# EAGLE design schematicNew (EAGLE 9.6.2)
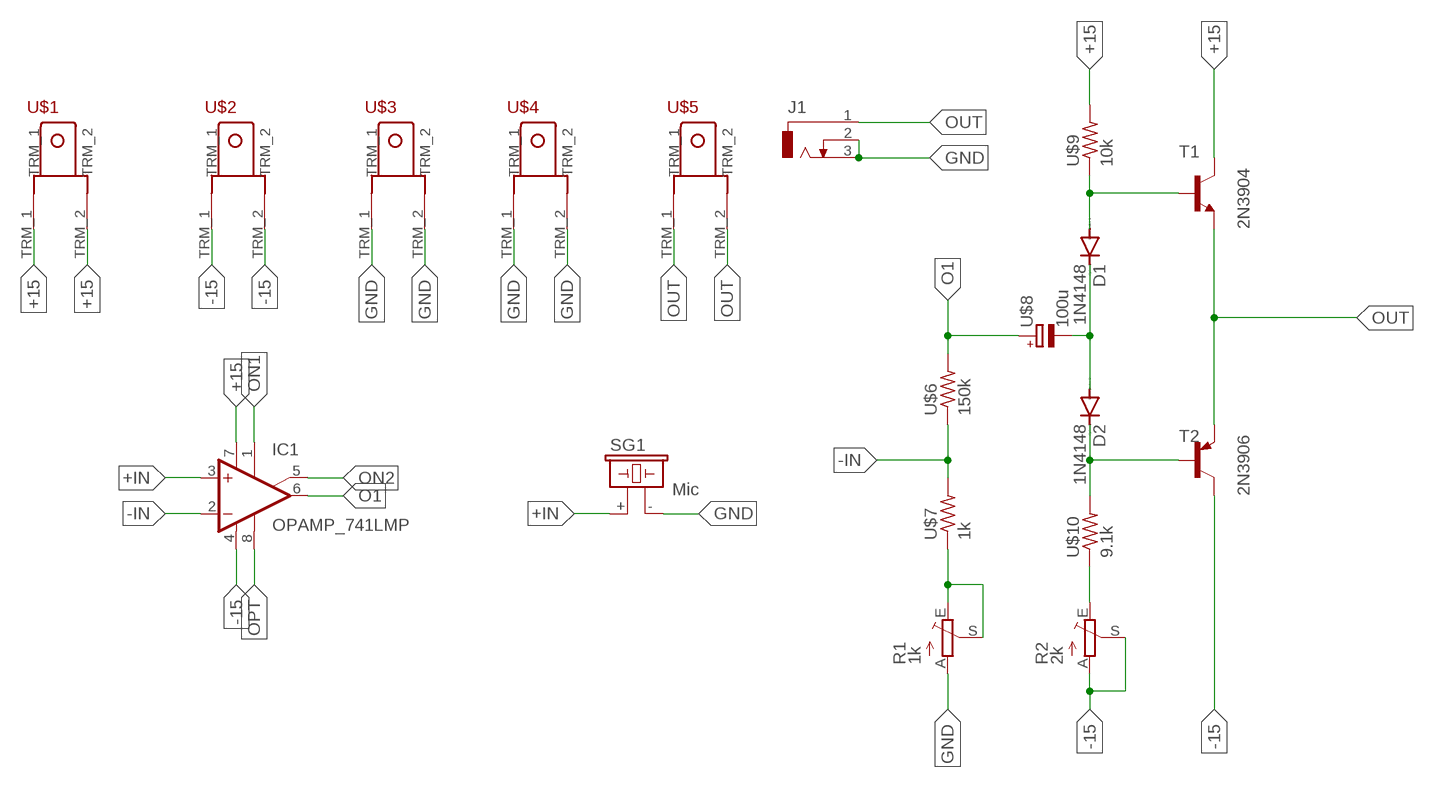
[diagram p0: schematic, sheet 1]

## Parts
D1  1N4148  1N4148DO35-10  [DO35-10]
D2  1N4148  1N4148DO35-10  [DO35-10]
IC1  OPAMP_741LMP  [DIL08]
J1  CON_JACK  [DCJ0303]
R1  1k  TRIM_EU-CA6V  [CA6V]
R2  2k  TRIM_EU-CA6V  [CA6V]
SG1  Mic  BUZZER  [F/CM12P]
T1  2N3904  2N3904-NPN-TO92-EBC  [TO92-EBC]
T2  2N3906  2N3906-PNP-TO92-EBC  [TO92-EBC]
U$1  TERMINAL_EDITED  [TERMINAL_EDITED]
U$2  TERMINAL_EDITED  [TERMINAL_EDITED]
U$3  TERMINAL_EDITED  [TERMINAL_EDITED]
U$4  TERMINAL_EDITED  [TERMINAL_EDITED]
U$5  TERMINAL_EDITED  [TERMINAL_EDITED]
U$6  150k  RES-7  [0204/7]
U$7  1k  RES-7  [0204/7]
U$8  100u  CAP_POL  [E3,5-8]
U$9  10k  RES-7  [0204/7]
U$10  9.1k  RES-7  [0204/7]

## Nets
+15: IC1.7(V+) T1.C U$1.TRM_1 U$1.TRM_2 U$9.2
+IN: IC1.3(+IN) SG1.+
-15: IC1.4(V-) R2.A R2.S T2.C U$2.TRM_1 U$2.TRM_2
-IN: IC1.2(-IN) U$6.1 U$7.2
GND: J1.2 J1.3 R1.A SG1.- U$3.TRM_1 U$3.TRM_2 U$4.TRM_1 U$4.TRM_2
N$1: D1.C D2.A U$8.-
N$2: D1.A T1.B U$9.1
N$3: R1.E R1.S U$7.1
N$4: D2.C T2.B U$10.2
N$5: R2.E U$10.1
O1: IC1.6(OUT) U$6.2 U$8.+
ON1: IC1.1(ON1)
ON2: IC1.5(ON2)
OPT: IC1.8(OPT)
OUT: J1.1 T1.E T2.E U$5.TRM_1 U$5.TRM_2

## Library data of the parts
D1 D2 = diode:1N4148: DIODE high speed (Philips)
IC1 = MIA_LIBRARY-2-2-2:OPAMP_741: OP AMP
J1 = MIA_LIBRARY-2-2-2:CON_JACK: DC POWER JACK Source: DCJ0303.pdf; OC_FARNELL: unknown; OC_NEWARK: unknown
R1 R2 = MIA_LIBRARY-2-2-2:TRIM_EU-: POTENTIOMETER
SG1 = MIA_LIBRARY-2-2-2:BUZZER: BUZZER Source: Buerklin; OC_FARNELL: unknown; OC_NEWARK: unknown
T1 = transistor-neu-to92:*-NPN-: NPN Transistror
T2 = transistor-neu-to92:*-PNP-: PNP Transistror
U$1-U$5 = MIA_LIBRARY-2-2-2:TERMINAL_EDITED
U$6 U$7 U$9 U$10 = MIA_LIBRARY-2-2-2:RES-7
U$8 = MIA_LIBRARY-2-2-2:CAP_POL

## Board
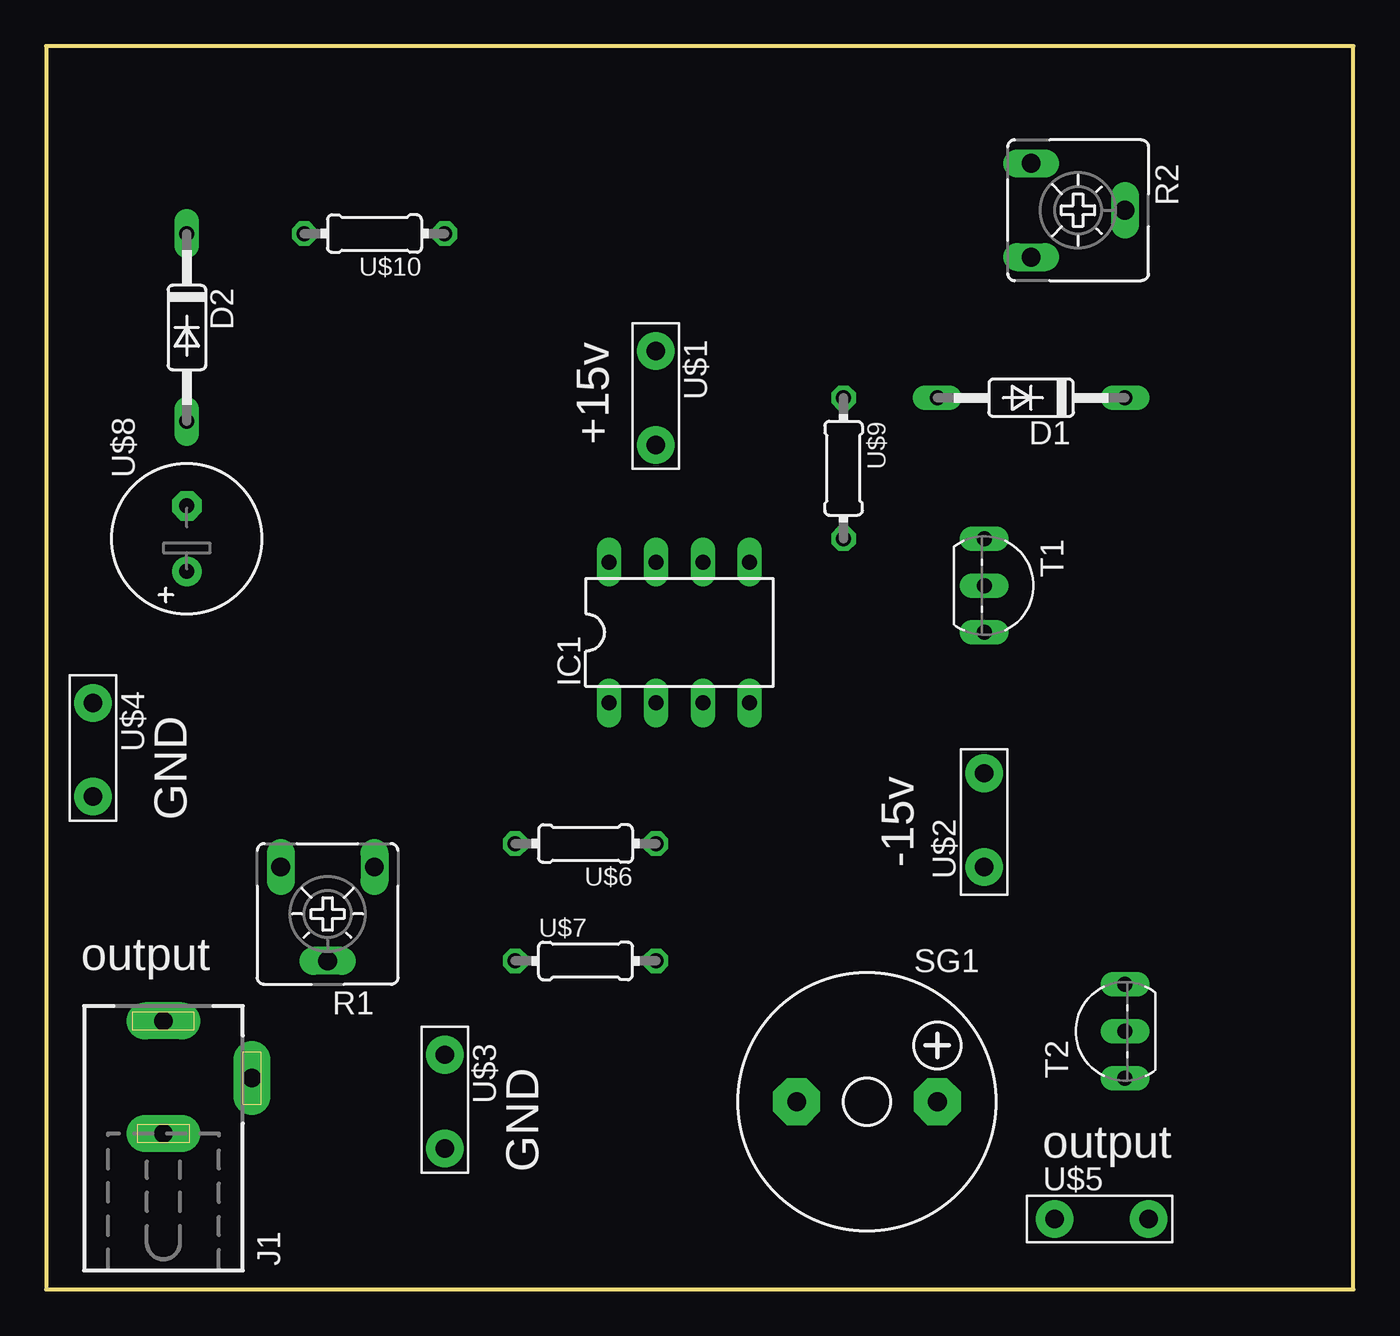
[diagram p1: board, top side]
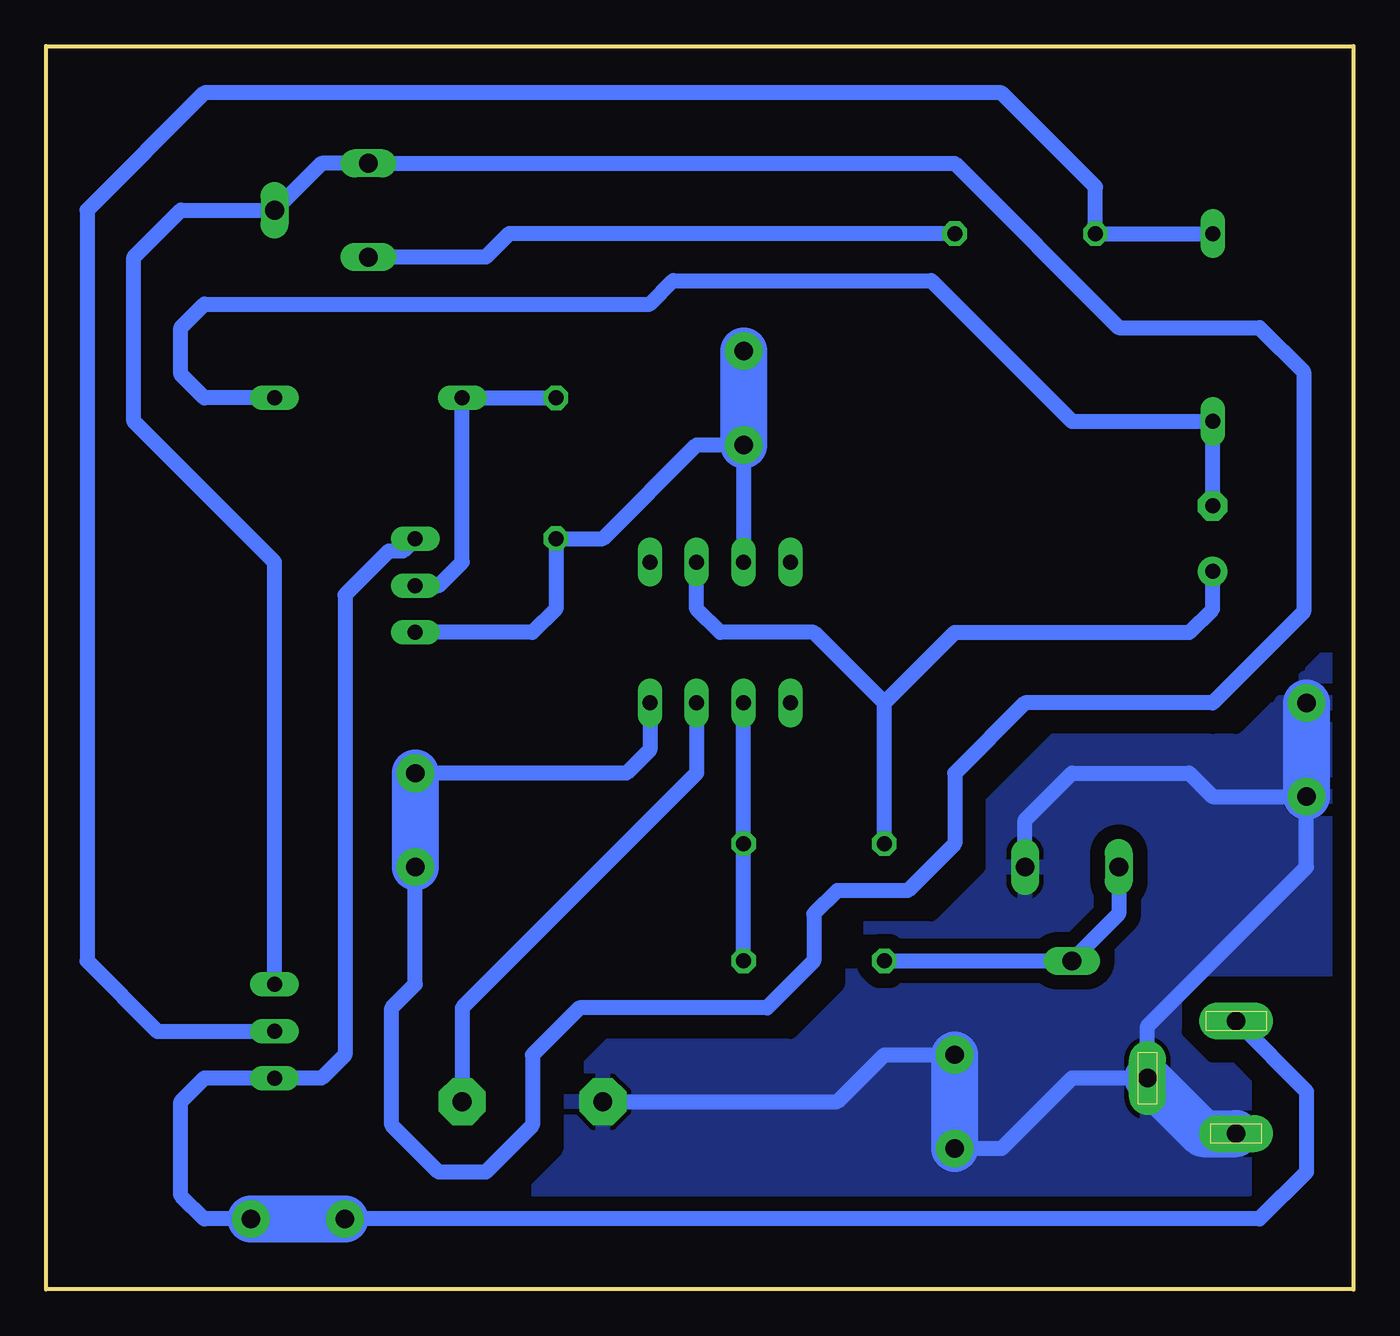
[diagram p2: board, bottom side, seen from below]

Size 70.79 x 67.3 mm. Coordinates in mm from the lower left corner, seen from the top.
Outline: 0,0 70.79,0 70.79,67.3 0,67.3 0,0
Copper layers (1*16): Top 0.035mm / dielectric 1.5mm / Bottom 0.035mm
Design rules "default *": minimum track width 6mil, minimum drill 0.35mm, track to track 0.8mm, track to pad 0.8mm, pad to pad 0.8mm, via to via 0.8mm, smd to smd 0.8mm, copper to edge 40mil, drill to drill 6mil, minimum pad ring 10mil, minimum via ring 8mil, stop-mask expansion 4mil, vias tented up to drill 0mil, thermal gap 10mil

### Footprints (pad centres in the part's own frame; a part is rotated, then mirrored left to right if it is on the bottom)
DO35-10 = drill 0.813 long: A 5.08,0; C -5.08,0
DIL08 = drill 0.813 long: 1 -3.81,-3.81; 2 -1.27,-3.81; 3 1.27,-3.81; 4 3.81,-3.81; 5 3.81,3.81; 6 1.27,3.81; 7 -1.27,3.81; 8 -3.81,3.81
DCJ0303 = drill 1 pad 2 long: 1 0,3.1; 2 4.8,0; 3 0,-3
CA6V = drill 1.016 long: A -2.54,-2.54; E 2.54,-2.54; S 0,2.54
F/CM12P = drill 1.016 pad 2.54 octagon: + 3.81,0; - -3.81,0
TO92-EBC = drill 0.813 long: B 0,-1.27; C 2.54,-1.27; E -2.54,-1.27
TERMINAL_EDITED = drill 1 pad 2.032: TRM_1 -2.54,0; TRM_2 2.54,0
0204/7 = drill 0.813 octagon: 1 -3.81,0; 2 3.81,0
E3,5-8 = drill 0.813 pad 1.6: + -1.778,0 | drill 0.813 pad 1.6 octagon: - 1.778,0

### Placement (x,y rotation side)
D1  53.34,48.26 180 top
D2  7.62,52.07 270 top
IC1  34.29,35.56 0 top
J1  6.35,11.43 0 top
R1  15.24,20.32 180 top
R2  55.88,58.42 270 top
SG1  44.45,10.16 0 top
T1  52.07,38.1 270 top
T2  57.15,13.97 90 top
U$1  33.02,48.26 270 top
U$2  50.8,25.4 90 top
U$3  21.59,10.16 270 top
U$4  2.54,29.21 270 top
U$5  57.15,3.81 0 top
U$6  29.21,24.13 180 top
U$7  29.21,17.78 0 top
U$8  7.62,40.64 90 top
U$9  43.18,44.45 270 top
U$10  17.78,57.15 180 top

### Tracks (layer width: path | path; a pad name or v marks a point on that pad's centre or on a via)
+15
  Bottom 0.813: IC1.7 U$1.TRM_2 35.56,45.72 40.64,40.64 U$9.2 43.18,36.83 44.45,35.56 T1.C
  Bottom 2.54: U$1.TRM_1 U$1.TRM_2
+IN
  Bottom 0.813: IC1.3 35.56,27.94 48.26,15.24 SG1.+
-15
  Bottom 0.813: IC1.4 38.1,29.21 39.37,27.94 U$2.TRM_2 | U$2.TRM_1 50.8,16.51 52.07,15.24 52.07,8.89 49.53,6.35 46.99,6.35 44.45,8.89 44.45,12.7 41.91,15.24 31.75,15.24 29.21,17.78 29.21,20.32 27.94,21.59 24.13,21.59 21.59,24.13 21.59,27.94 17.78,31.75 7.62,31.75 2.69,36.68 2.69,49.68 5.08,52.07 12.7,52.07 21.59,60.96 R2.A 55.88,60.96 R2.S 63.5,58.42 66.04,55.88 66.04,46.99 58.42,39.37 T2.C
  Bottom 2.54: U$2.TRM_2 U$2.TRM_1
-IN
  Bottom 0.813: U$7.2 U$6.1 IC1.2
GND
  Bottom 0.813: U$3.TRM_2 19.05,7.62 15.24,11.43 J1.2 11.15,14.25 2.54,22.86 U$4.TRM_2 7.62,26.67 8.89,27.94 15.24,27.94 17.78,25.4 R1.A | SG1.- 27.94,10.16 25.4,12.7 U$3.TRM_1
  Bottom 2.54: U$3.TRM_2 U$3.TRM_1 | U$4.TRM_1 U$4.TRM_2 | J1.2 8.15,8.43 J1.3
  pour Bottom: 0,0 0,67.31 71.12,67.31 71.12,0
  cutout Bottom (isolate 0.61): 0,16.51 8.89,16.51 8.89,13.97 7.62,12.7 6.35,12.7 5.08,11.43 5.08,6.35 5.08,3.81 0,3.81
  cutout Bottom (isolate 0.61): 1.27,35.56 6.35,30.48 7.62,30.48 16.51,30.48 20.32,26.67 20.32,22.86 22.86,20.32 26.67,20.32 27.94,19.05 27.94,16.51 30.48,13.97 40.64,13.97 43.18,11.43 43.18,7.62 45.72,5.08 49.53,5.08 49.53,35.56
N$1
  Bottom 0.813: U$8.- D2.A 15.24,46.99 22.86,54.61 36.83,54.61 38.1,53.34 62.23,53.34 63.5,52.07 63.5,49.53 62.23,48.26 D1.C
N$2
  Bottom 0.813: U$9.1 D1.A 48.26,39.37 49.53,38.1 T1.B
N$3
  Bottom 0.813: U$7.1 R1.S 12.7,20.32 R1.E
N$4
  Bottom 0.813: D2.C U$10.2 13.97,59.69 19.05,64.77 62.23,64.77 68.58,58.42 68.58,17.78 64.77,13.97 T2.B
N$5
  Bottom 0.813: U$10.1 45.72,57.15 46.99,55.88 R2.E
O1
  Bottom 0.813: U$6.2 25.4,31.75 | IC1.6 35.56,36.83 34.29,35.56 29.21,35.56 25.4,31.75 | 25.4,31.75 21.59,35.56 8.89,35.56 7.62,36.83 U$8.+
OUT
  Bottom 0.813: U$5.TRM_2 62.23,3.81 63.5,5.08 63.5,10.16 62.23,11.43 T2.E 55.88,11.43 54.61,12.7 54.61,37.59 52.23,39.97 51.47,39.97 T1.E | J1.1 2.54,10.72 2.54,6.35 5.08,3.81 U$5.TRM_1
  Bottom 2.54: U$5.TRM_2 U$5.TRM_1

### Text on the board
tPlace: +15v | GND | -15v | output | output | GND